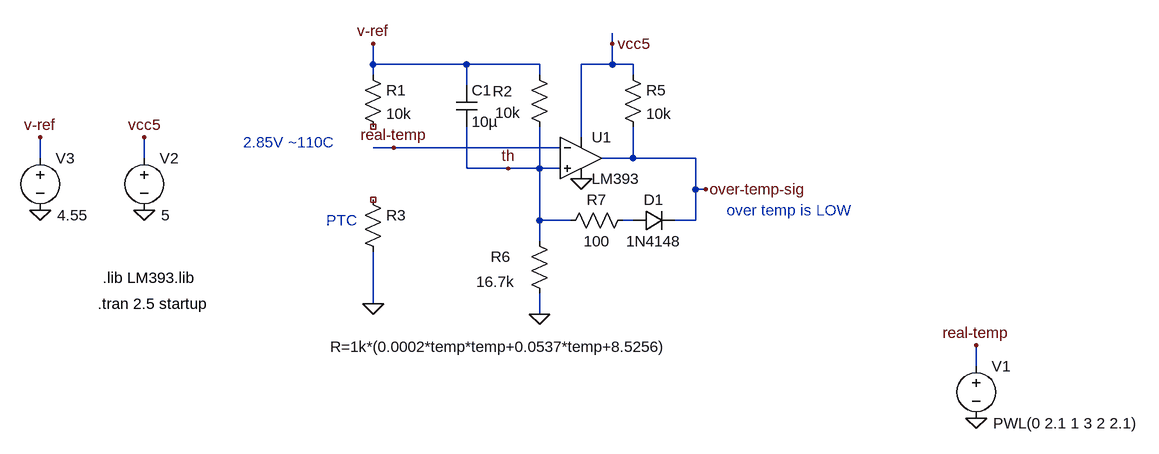
[diagram p0: schematic over-temp-latch2.asc]
over-temp-latch2.asc, the LTspice schematic file:
Version 4
SHEET 1 2052 680
WIRE 320 -80 320 -96
WIRE -48 -48 -48 -80
WIRE 96 -48 -48 -48
WIRE 208 -48 96 -48
WIRE 320 -48 320 -80
WIRE 320 -48 272 -48
WIRE 352 -48 320 -48
WIRE -48 -32 -48 -48
WIRE 208 -32 208 -48
WIRE 352 -32 352 -48
WIRE 96 -16 96 -48
WIRE 272 64 272 -48
WIRE -16 80 -48 80
WIRE 240 80 -16 80
WIRE -560 96 -560 64
WIRE -400 96 -400 64
WIRE 352 96 352 48
WIRE 352 96 304 96
WIRE 448 96 352 96
WIRE 96 112 96 48
WIRE 160 112 96 112
WIRE 208 112 208 48
WIRE 208 112 160 112
WIRE 240 112 208 112
WIRE 448 144 448 96
WIRE 464 144 448 144
WIRE 208 192 208 112
WIRE 256 192 208 192
WIRE 352 192 336 192
WIRE 448 192 448 144
WIRE 448 192 416 192
WIRE 208 224 208 192
WIRE -48 320 -48 240
WIRE 208 336 208 304
WIRE 880 416 880 384
FLAG -400 176 0
FLAG -400 64 vcc5
FLAG -48 320 0
FLAG 272 128 0
FLAG -16 80 real-temp
FLAG -560 176 0
FLAG -560 64 v-ref
FLAG -48 -80 v-ref
FLAG 208 336 0
FLAG 464 144 over-temp-sig
FLAG 880 496 0
FLAG 880 384 real-temp
FLAG 160 112 th
FLAG 320 -80 vcc5
SYMBOL voltage -400 80 R0
WINDOW 3 26 104 Left 2
WINDOW 123 0 0 Left 0
WINDOW 39 0 0 Left 0
SYMATTR Value 5
SYMATTR InstName V2
SYMBOL res -64 -48 R0
SYMATTR InstName R1
SYMATTR Value 10k
SYMBOL res -64 144 R0
WINDOW 3 -50 242 Left 2
SYMATTR Value R=1k*(0.0002*temp*temp+0.0537*temp+8.5256)
SYMATTR InstName R3
SYMBOL OpAmps\\opamp2 272 32 R0
SYMATTR InstName U1
SYMATTR Value LM393
SYMBOL res 336 -48 R0
SYMATTR InstName R5
SYMATTR Value 10k
SYMBOL voltage -560 80 R0
WINDOW 3 26 104 Left 2
WINDOW 123 0 0 Left 0
WINDOW 39 0 0 Left 0
SYMATTR Value 4.55
SYMATTR InstName V3
SYMBOL res 192 -48 R0
WINDOW 0 -56 41 Left 2
WINDOW 3 -52 74 Left 2
SYMATTR InstName R2
SYMATTR Value 10k
SYMBOL res 192 208 R0
WINDOW 0 -59 40 Left 2
WINDOW 3 -81 78 Left 2
SYMATTR InstName R6
SYMATTR Value 16.7k
SYMBOL voltage 880 400 R0
WINDOW 3 26 104 Left 2
WINDOW 123 0 0 Left 0
WINDOW 39 0 0 Left 0
SYMATTR Value PWL(0 2.1 1 3 2 2.1)
SYMATTR InstName V1
SYMBOL diode 352 208 R270
WINDOW 0 32 32 VTop 2
WINDOW 3 0 32 VBottom 2
SYMATTR InstName D1
SYMATTR Value 1N4148
SYMBOL res 352 176 R90
WINDOW 0 0 56 VBottom 2
WINDOW 3 32 56 VTop 2
SYMATTR InstName R7
SYMATTR Value 100
SYMBOL cap 80 -16 R0
SYMATTR InstName C1
SYMATTR Value 10µ
SYMATTR SpiceLine Rser=4
TEXT -464 280 Left 2 !.lib LM393.lib
TEXT -120 192 Left 2 ;PTC
TEXT -472 320 Left 2 !.tran 2.5 startup
TEXT -248 72 Left 2 ;2.85V ~110C
TEXT 496 176 Left 2 ;over temp is LOW

The netlist it stands for:
* over-temp-latch2.asc
V2 vcc5 0 5
R1 v-ref NC_01 10k
R3 NC_02 0 R=1k*(0.0002*temp*temp+0.0537*temp+8.5256)
XU1 th real-temp vcc5 0 over-temp-sig LM393  ; pins In+ In- V+ V- OUT
R5 vcc5 over-temp-sig 10k
V3 v-ref 0 4.55
R2 v-ref th 10k
R6 th 0 16.7k
V1 real-temp 0 PWL(0 2.1 1 3 2 2.1)
D1 N001 over-temp-sig 1N4148
R7 N001 th 100
C1 v-ref th 10µ Rser=4
.model D D
.lib standard.dio
.lib LM393.lib
* PTC
.tran 2.5 startup
* 2.85V ~110C
* over temp is LOW
.backanno
.end